# EAGLE design AndrewSaLoutos_pcb (EAGLE 8.1.0)
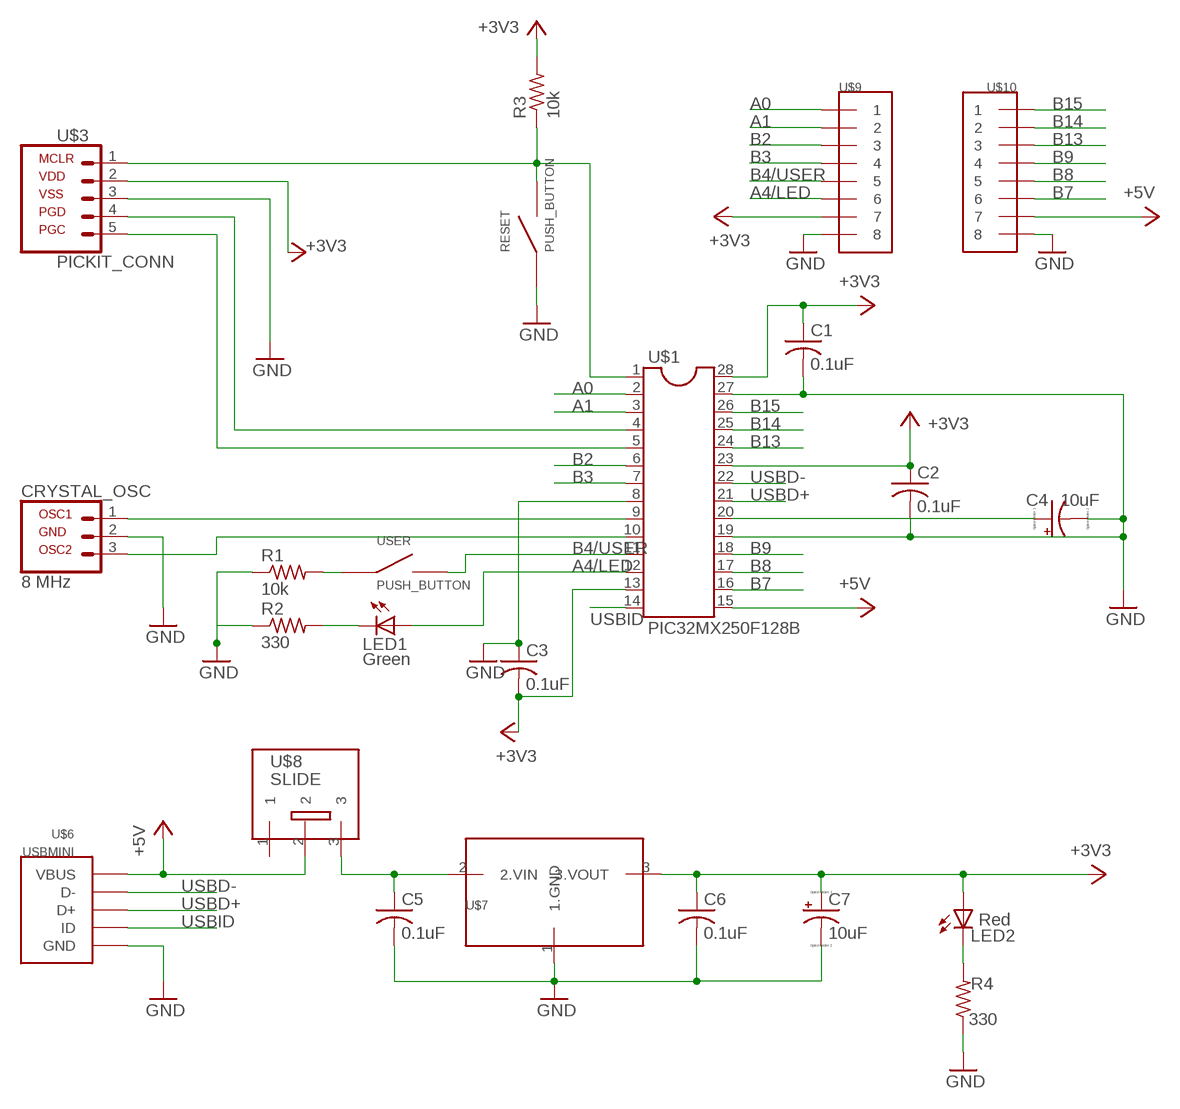
[diagram p0: schematic, sheet 1]

## Parts
C1  0.1uF  C-US050-030X075  [C050-030X075]
C2  0.1uF  C-US050-030X075  [C050-030X075]
C3  0.1uF  C-US050-030X075  [C050-030X075]
C4  10uF  CPOL-USE2.5-6  [E2,5-6]
C5  0.1uF  C-US050-030X075  [C050-030X075]
C6  0.1uF  C-US050-030X075  [C050-030X075]
C7  10uF  CPOL-USE2.5-6  [E2,5-6]
CRYSTAL_OSC  8 MHz  CRYSTAL_OSC  [1X03]
LED1  Green  LED3MM  [LED3MM]
LED2  Red  LED3MM  [LED3MM]
R1  10k  R-US_0207/10  [0207/10]
R2  330  R-US_0207/10  [0207/10]
R3  10k  R-US_0207/10  [0207/10]
R4  330  R-US_0207/10  [0207/10]
RESET  PUSH_BUTTON  [PUSH_BUTTON]
U$1  PIC32MX250F128B  [DIL28-3]
U$3  PICKIT_CONN  [1X05]
U$6  USBMINI  USBMINI_GOOD  [USB-MB-H]
U$7  MCP1702  [TO92]
U$8  SLIDE  [SLIDE]
U$9  8PIN_HEADER  [8PIN_HEADER]
U$10  8PIN_HEADER  [8PIN_HEADER]
USER  PUSH_BUTTON  [PUSH_BUTTON]

## Nets
+3V3: C1.1 C2.1 C3.2 C6.1 C7.+ LED2.A R3.2 U$1.13(13.VDD) U$1.23(23.VUSB3.3) U$1.28(28.AVDD) U$3.2(2.VDD) U$7.3(3.VOUT) U$9.7
+5V: U$1.15(15.VBUS) U$6.VBUS U$8.2 U$10.7
A0: U$1.2 U$9.1
A1: U$1.3 U$9.2
A4/LED: LED1.A U$1.12(12.RA4) U$9.6
B2: U$1.6 U$9.3
B3: U$1.7 U$9.4
B4/USER: U$1.11(11.RB4) U$9.5 USER.3(OUT)
B7: U$1.16 U$10.6
B8: U$1.17 U$10.5
B9: U$1.18 U$10.4
B13: U$1.24 U$10.3
B14: U$1.25 U$10.2
B15: U$1.26 U$10.1
GND: C1.2 C2.2 C3.1 C4.- C5.2 C6.2 C7.- CRYSTAL_OSC.2(2.GND) R1.1 R2.1 R4.1 RESET.1(IN) U$1.8(8.VSS) U$1.19(19.VSS) U$1.27(27.AVSS) U$3.3(3.VSS) U$6.GND U$7.1(1.GND) U$9.8 U$10.8
N$1: C4.+ U$1.20(20.VCAP)
N$2: CRYSTAL_OSC.1(1.OSC1) U$1.9(9.OSC1)
N$3: CRYSTAL_OSC.3(3.OSC2) U$1.10(10.OSC2)
N$4: R1.2 USER.1(IN)
N$6: LED1.K(C) R2.2
N$7: U$1.5(5.PGEC1) U$3.5(5.PGC)
N$8: U$1.4(4.PGED1) U$3.4(4.PGD)
N$9: R3.1 RESET.3(OUT) U$1.1(1.MCLR) U$3.1(1.MCLR)
N$11: C5.1 U$7.2(2.VIN) U$8.3
N$17: LED2.K(C) R4.2
USBD+: U$1.21 U$6.D+
USBD-: U$1.22 U$6.D-
USBID: U$1.14 U$6.ID
Unconnected: U$8.1

## Library data of the parts
C1-C3 C5 C6 = 433_lib:C-US: CAPACITOR, American symbol
C4 C7 = 433_lib:CPOL-US: POLARIZED CAPACITOR, American symbol
CRYSTAL_OSC = 433_lib:CRYSTAL_OSC
LED1 LED2 = 433_lib:LED: LED OSRAM: - CHIPLED LG R971, LG N971, LY N971, LG Q971, LY Q971, LO R971, LY R971 LH N974, LH R974 LS Q976, LO Q976, LY Q976 LO Q996 - Hyper CHIPLED LW Q18S LB Q993, LB Q99A, LB R99A - SideLED LS A670, LO A670, LY A670, LG A670, LP A670 LB A673, LV A673, LT A673, LW A673 LH A674 LY A675 LS A676, LA A676, LO A676, LY A676, LW A676 LS A679, LY A679, LG A679 - Hyper Micro SIDELED® LS Y876, LA Y876, LO Y876, LY Y876 LT Y87S - SmartLED LW L88C, LW L88S LB L89C, LB L89S, LG L890 LS L89K, LO L89K, LY L89K LS L896, LA L896, LO L896, LY L896 - TOPLED LS T670, LO T670, LY T670, LG T670, LP T670 LSG T670, LSP T670, LSY T670, LOP T670, LYG T670 LG T671, LOG T671, LSG T671 LB T673, LV T673, LT T673, LW T673 LH T674 LS T676, LA T676, LO T676, LY T676, LB T676, LH T676, LSB T676, LW T676 LB T67C, LV T67C, LT T67C, LS T67K, LO T67K, LY T67K, LW E67C LS E67B, LA E67B, LO E67B, LY E67B, LB E67C, LV E67C, LT E67C LW T67C LS T679, LY T679, LG T679 LS T770, LO T770, LY T770, LG T770, LP T770 LB T773, LV T773, LT T773, LW T773 LH T774 LS E675, LA E675, LY E675, LS T675 LS T776, LA T776, LO T776, LY T776, LB T776 LHGB T686 LT T68C, LB T68C - Hyper Mini TOPLED® LB M676 - Mini TOPLED Santana® LG M470 LS M47K, LO M47K, LY M47K Source: http://www.osram.convergy.de LUXEON: - LUMILED® LXK2-PW12-R00, LXK2-PW12-S00, LXK2-PW14-U00, LXK2-PW14-V00 LXK2-PM12-R00, LXK2-PM12-S00, LXK2-PM14-U00 LXK2-PE12-Q00, LXK2-PE12-R00, LXK2-PE12-S00, LXK2-PE14-T00, LXK2-PE14-U00 LXK2-PB12-K00, LXK2-PB12-L00, LXK2-PB12-M00, LXK2-PB14-N00, LXK2-PB14-P00, LXK2-PB14-Q00 LXK2-PR12-L00, LXK2-PR12-M00, LXK2-PR14-Q00, LXK2-PR14-R00 LXK2-PD12-Q00, LXK2-PD12-R00, LXK2-PD12-S00 LXK2-PH12-R00, LXK2-PH12-S00 LXK2-PL12-P00, LXK2-PL12-Q00, LXK2-PL12-R00 Source: www.luxeon.com KINGBRIGHT: KA-3528ASYC Source: www.kingbright.com
R1-R4 = 433_lib:R-US_: RESISTOR, American symbol
RESET USER = 433_lib:PUSH_BUTTON
U$1 = 433_lib:PIC32MX250F128B
U$3 = 433_lib:PICKIT_CONN
U$6 = 433_lib:USBMINI_GOOD
U$7 = 433_lib:MCP1702
U$8 = 433_lib:SLIDE
U$9 U$10 = 433_lib:8PIN_HEADER

## Board
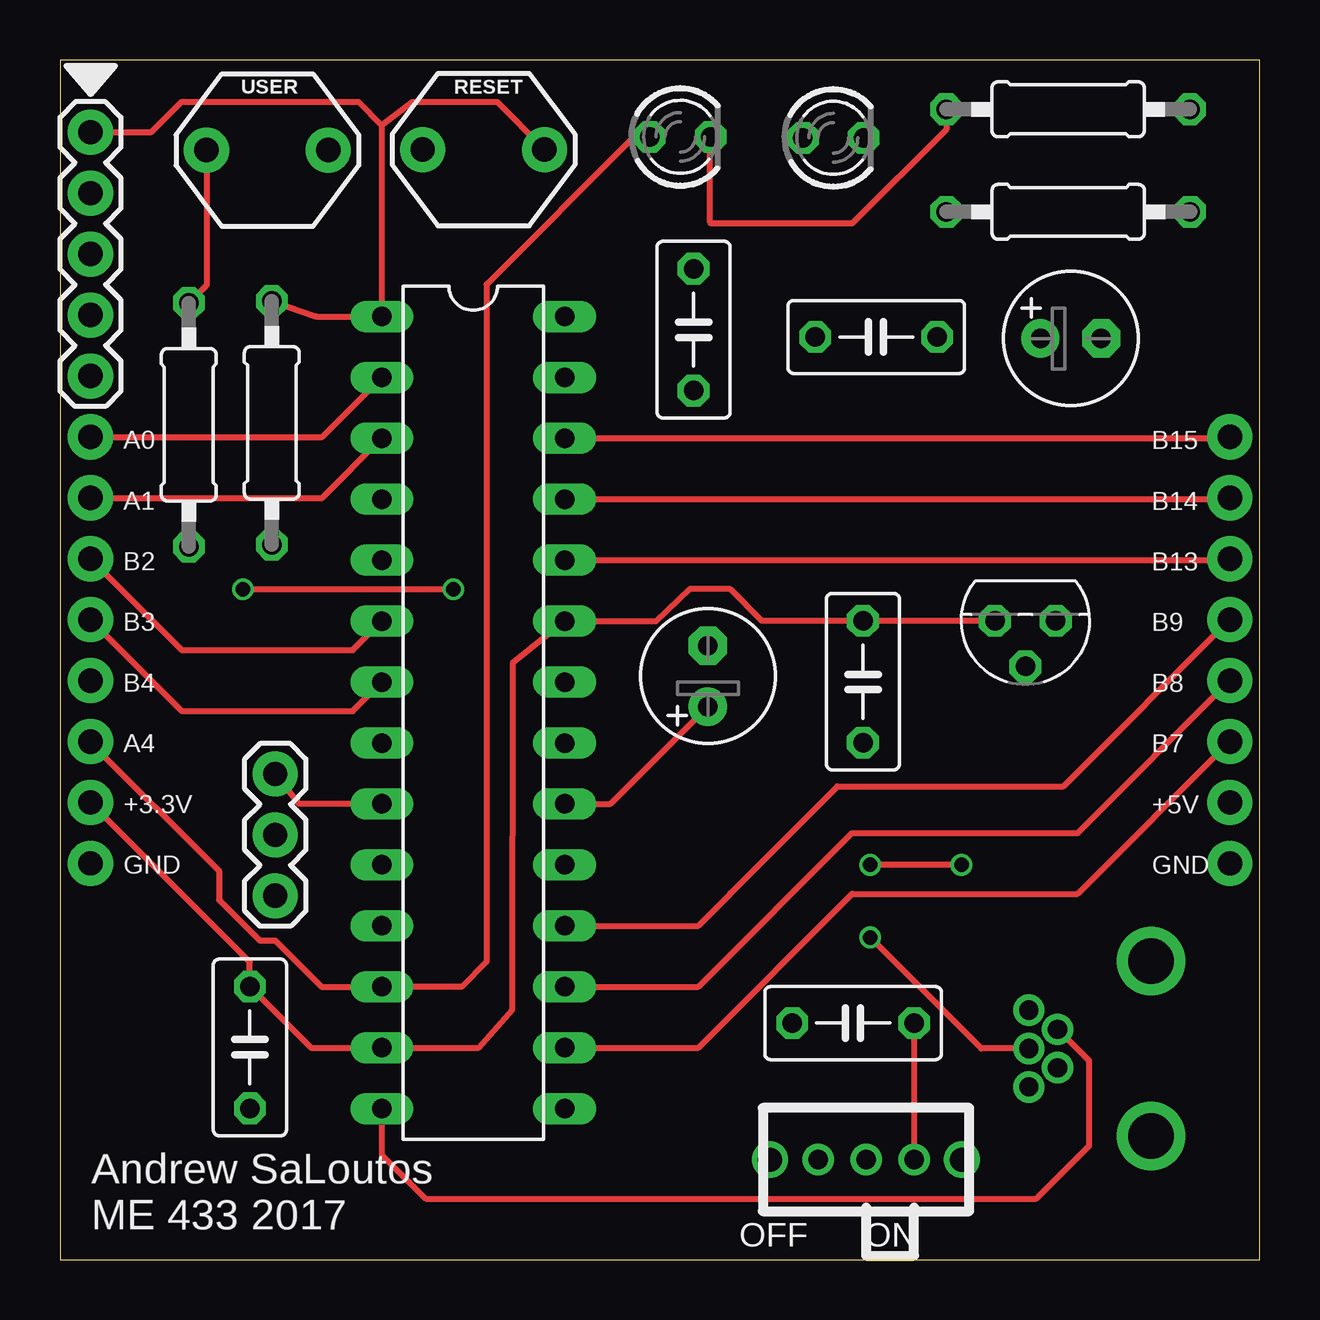
[diagram p1: board, top side]
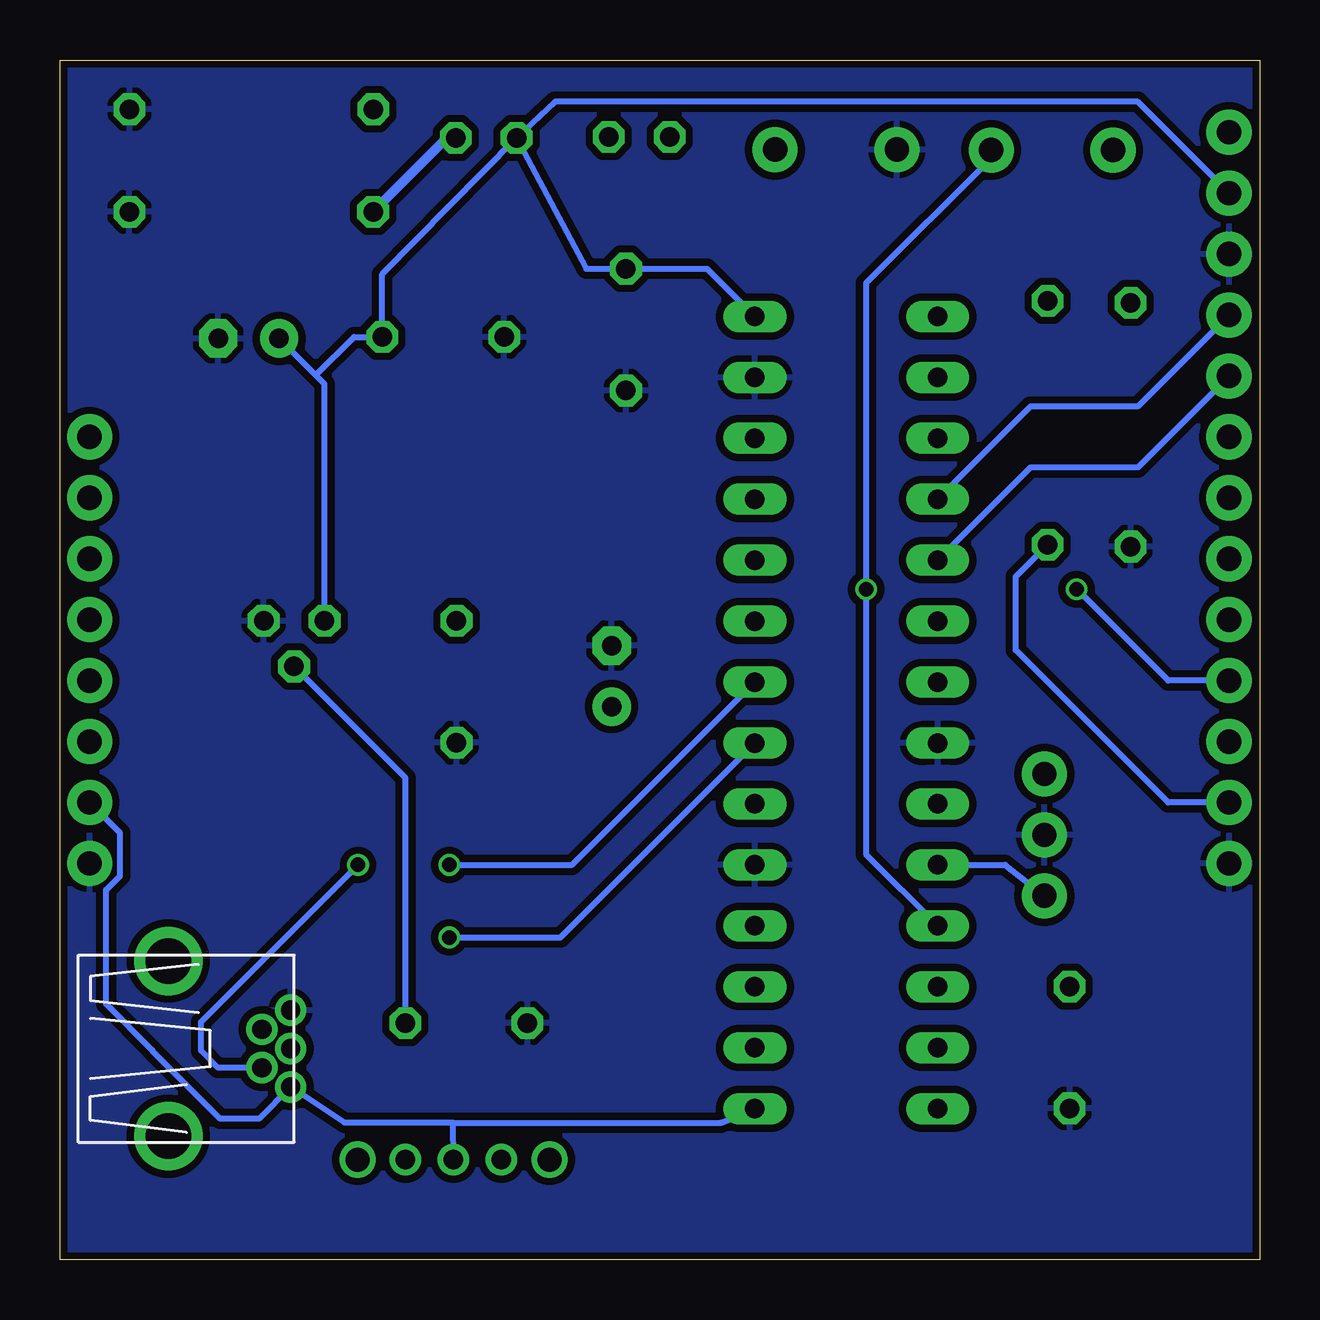
[diagram p2: board, bottom side, seen from below]

Size 50 x 50 mm. Coordinates in mm from the lower left corner, seen from the top.
Outline: 0,0 50,0 50,50 0,50 0,0
Copper layers (1*16): Top 0.035mm / dielectric 1.5mm / Bottom 0.035mm
Design rules "SeeedStudio_2layer_DRU_no_angle_20140221": minimum track width 6mil, minimum drill 12mil, track to track 6mil, track to pad 6mil, pad to pad 6mil, via to via 6mil, smd to smd 0mil, copper to edge 10mil, drill to drill 10mil, minimum pad ring 10mil, minimum via ring 6mil, stop-mask expansion 2mil, vias tented up to drill 100mil, thermal gap 10mil

### Footprints (pad centres in the part's own frame; a part is rotated, then mirrored left to right if it is on the bottom)
C050-030X075 = drill 0.813 octagon: 1 -2.54,0; 2 2.54,0
E2,5-6 = drill 0.813 pad 1.6: + -1.27,0 | drill 0.813 pad 1.6 octagon: - 1.27,0
1X03 = drill 1.016 pad 1.88: 1 0,0; 2 2.54,0; 3 5.08,0
LED3MM = drill 0.813 octagon: A -1.27,0; K 1.27,0
0207/10 = drill 0.813 octagon: 1 -5.08,0; 2 5.08,0
PUSH_BUTTON = drill 1.016 pad 1.88: 1 0,0; 3 5.08,0
DIL28-3 = drill 0.813 long: 1 -16.51,-3.81; 2 -13.97,-3.81; 3 -11.43,-3.81; 4 -8.89,-3.81; 5 -6.35,-3.81; 6 -3.81,-3.81; 7 -1.27,-3.81; 8 1.27,-3.81; 9 3.81,-3.81; 10 6.35,-3.81; 11 8.89,-3.81; 12 11.43,-3.81; 13 13.97,-3.81; 14 16.51,-3.81; 15 16.51,3.81; 16 13.97,3.81; 17 11.43,3.81; 18 8.89,3.81; 19 6.35,3.81; 20 3.81,3.81; 21 1.27,3.81; 22 -1.27,3.81; 23 -3.81,3.81; 24 -6.35,3.81; 25 -8.89,3.81; 26 -11.43,3.81; 27 -13.97,3.81; 28 -16.51,3.81
1X05 = drill 1.016 pad 1.88: 1 0,0; 2 2.54,0; 3 5.08,0; 4 7.62,0; 5 10.16,0
USB-MB-H = drill 0.8: D+ 5.1,0; D- 3.9,0.8; GND 5.1,-1.6; ID 3.9,-0.8; VBUS 5.1,1.6 | drill 1.9: P$6 0,-3.65; P$7 0,3.65
TO92 = drill 0.813 octagon: 1 -1.27,0; 2 0,1.905; 3 1.27,0
SLIDE = drill 0.8: 1 -2,0; 2 0,0; 3 2,0 | drill 1: P$1 -4,0; P$2 4,0
8PIN_HEADER = drill 1.016 pad 1.88: 1 0,0; 2 2.54,0; 3 5.08,0; 4 7.62,0; 5 10.16,0; 6 12.7,0; 7 15.24,0; 8 17.78,0

### Placement (x,y rotation side)
C1  26.41,38.76 270 top
C2  33.47,24.09 270 top
C3  7.92,8.84 90 top
C4  27,24.32 90 top
C5  33.06,9.86 180 top
C6  34.02,38.45 180 top
C7  42.13,38.4 0 top
CRYSTAL_OSC  8.97,20.24 270 top
LED1  25.86,46.8 0 top
LED2  32.23,46.76 0 top
R1  5.37,34.8 90 top
R2  42.02,47.95 180 top
R3  8.83,34.88 270 top
R4  42.02,43.67 180 top
RESET  15.12,46.27 0 top
U$1  17.23,22.8 270 top
U$3  1.27,46.99 270 top
U$6  45.48,8.79 180 top
U$7  40.24,26.62 180 top
U$8  33.6,4.17 0 top
U$9  1.27,34.29 270 top
U$10  48.77,34.29 270 top
USER  6.11,46.24 0 top

### Tracks (layer width: path | path; a pad name or v marks a point on that pad's centre or on a via)
+3V3
  Top 0.254: U$7.3 C2.1 29.25,26.62 27.94,27.94 26.24,27.94 24.82,26.6 21.48,26.6 U$1.23 18.88,24.88 18.86,10.44 17.45,8.83 U$1.13 10.46,8.83 C3.2 7.92,12.4 U$9.7
  Bottom 0.254: U$7.3 38.97,36.5 39.34,36.87 | 39.34,36.87 C7.+ | 39.34,36.87 37.74,38.45 C6.1 36.56,41.07 LED2.A | LED2.A 28.05,41.3 C1.1 23.02,41.3 U$1.28 | U$9.7 3.81,19.05 10.16,25.4 10.16,28.46 R3.2 | U$3.2 5.08,48.26 29.38,48.26 LED2.A
+5V
  Bottom 0.254: U$8.2 33.62,5.7 | 33.62,5.7 38.14,5.7 U$6.VBUS 41.7,5.88 43.33,5.88 46.15,8.7 46.15,8.72 48.08,10.65 48.08,15.41 47.5,15.98 47.5,17.78 U$10.7 | 33.62,5.7 22.45,5.7 U$1.15
A0
  Top 0.254: U$9.1 10.94,34.29 U$1.2
A1
  Top 0.254: U$9.2 10.94,31.75 U$1.3
A4/LED
  Top 0.254: LED1.A 23.93,46.8 17.78,40.64 17.78,12.4 16.75,11.38 U$1.12 10.9,11.38 8.97,13.3 8.32,13.3 6.62,15 6.62,16.2 1.27,21.55 U$9.6
B2
  Top 0.254: U$9.3 5.08,25.4 12.21,25.4 U$1.6
B3
  Top 0.254: U$9.4 5.08,22.86 12.21,22.86 U$1.7
B4/USER  (via drill 0.6)
  Top 0.254: v7.62,27.94 v16.4,27.94
  Bottom 0.254: 13.43,13.93 U$1.11 16.4,16.89 v16.4,27.94 16.4,40.7 11.19,45.91 USER.3 | U$9.5 3.81,24.13 v7.62,27.94
B7
  Top 0.254: U$1.16 26.61,8.83 33.02,15.24 42.42,15.24 U$10.6
B8
  Top 0.254: U$1.17 26.61,11.37 33.02,17.78 42.42,17.78 U$10.5
B9
  Top 0.254: U$1.18 26.61,13.91 27.94,15.24 27.94,15.27 32.4,19.73 41.82,19.73 U$10.4
B13
  Top 0.254: U$1.24 48.77,29.15 U$10.3
B14
  Top 0.254: U$1.25 48.77,31.69 U$10.2
B15
  Top 0.254: U$1.26 48.77,34.23 U$10.1
GND
  pour Bottom (isolate 0.305): 0,0 0.03,49.95 50.02,49.98 50,0
N$1
  Top 0.254: U$1.20 22.95,18.99 C4.+
N$2
  Top 0.254: U$1.9 9.97,18.99 CRYSTAL_OSC.1
N$3
  Bottom 0.254: U$1.10 10.61,16.45 CRYSTAL_OSC.3
N$4
  Top 0.254: USER.1 6.11,40.61 R1.2
N$6
  Top 0.254: R2.2 36.94,47.1 33.02,43.18 27.14,43.18 27.1,43.23 27.1,46.77 LED1.K
N$7
  Bottom 0.254: U$3.5 5.08,33.02 9.54,33.02 U$1.5
N$8
  Bottom 0.254: U$3.4 5.08,35.56 9.54,35.56 U$1.4
N$9
  Top 0.254: R3.1 10.7,39.3 U$1.1 13.41,47.28 | 13.41,47.28 14.69,48.26 18.23,48.26 RESET.3 | U$3.1 3.81,46.99 5.08,48.26 12.44,48.26 13.41,47.28
N$11
  Top 0.254: C5.1 U$8.3
  Bottom 0.254: C5.1 35.6,20.08 U$7.2
N$17
  Bottom 0.406: LED2.K 33.86,46.76 R4.2
USBD+  (via drill 0.6)
  Top 0.254: U$6.D+ 38.41,8.79 v33.77,13.43 | v33.77,13.43 33.75,13.45 v33.77,13.43
  Bottom 0.254: v33.77,13.43 29.14,13.43 U$1.21
USBD-  (via drill 0.6)
  Top 0.254: v37.58,16.45 v33.77,16.45 | v33.77,16.45 33.75,16.45 v33.77,16.45
  Bottom 0.254: U$6.D- 43.42,8 44.12,8.7 44.12,9.9 v37.58,16.45 | v37.58,16.45 37.55,16.48 v37.58,16.45 | v33.77,16.45 28.66,16.45 U$1.22
USBID
  Top 0.254: U$1.14 13.41,4.37 15.24,2.54 40.69,2.54 42.9,4.75 42.9,8.28 U$6.ID

### Text on the board
tPlace: A0 / A1 / B2 / B3 / B4 / A4 / +3.3V / GND | B15 / B14 / B13 / B9 / B8 / B7 / +5V / GND | Andrew SaLoutos / ME 433 2017 | OFF ON